# Altium schematic sheet BSPD.SchDoc
size A
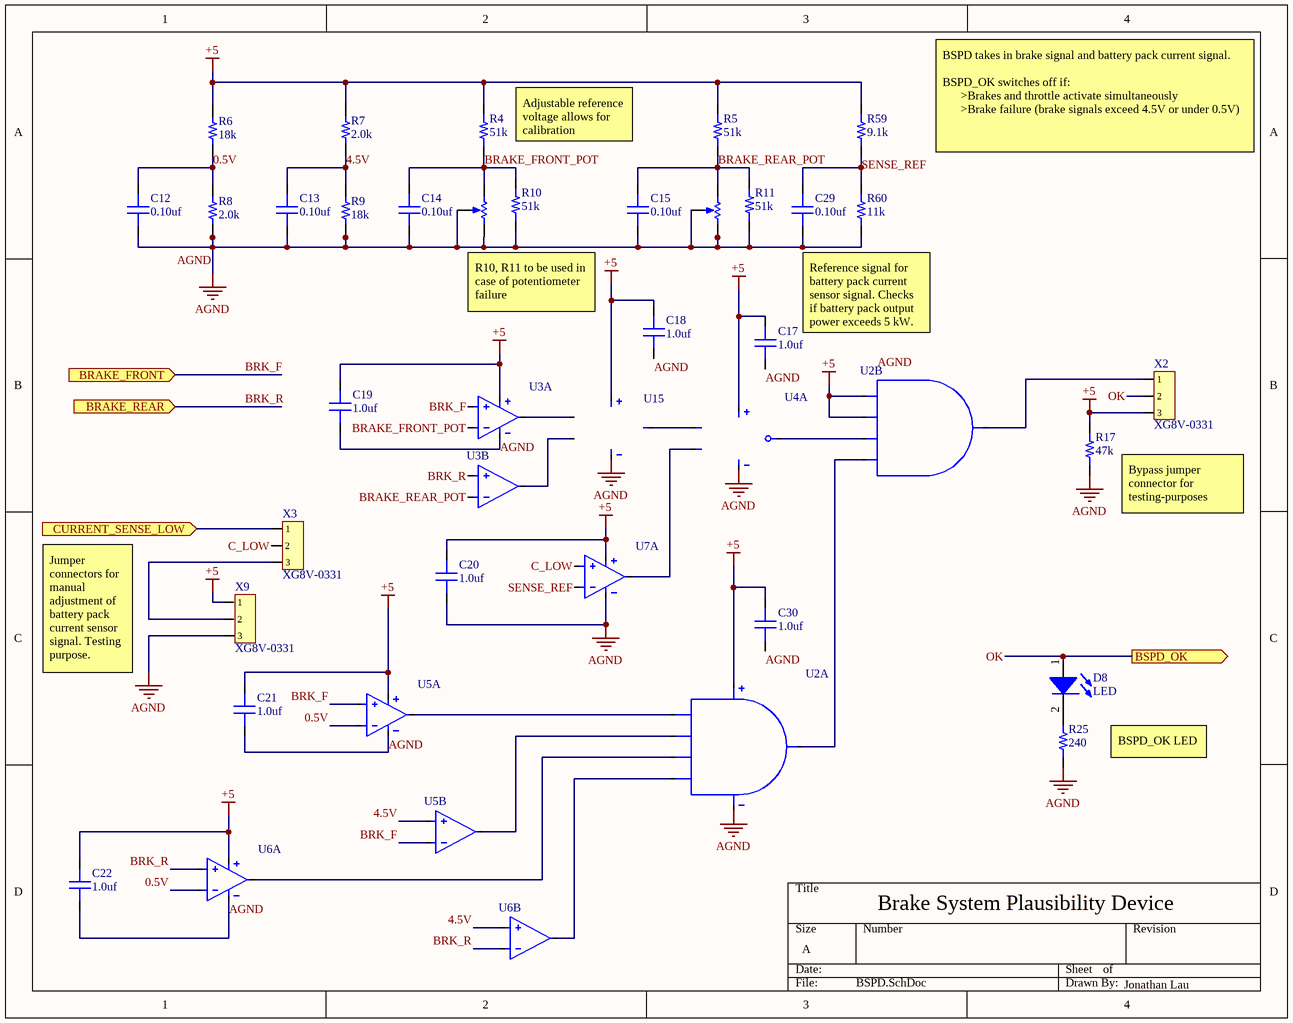
[diagram p0: BSPD.SchDoc]

## Parts
BRAKE_FRONT_POT  RV6LAYSA502A  [RV6LAYSA502A]  (value not drawn)
BRAKE_REAR_POT  RV6LAYSA502A  [RV6LAYSA502A]  (value not drawn)
C12  value 0.10uf  [CAP 0805/2012]  (hidden comment: Capacitor MLCC 0.10uf 16V CAP 0805/2012)
C13  value 0.10uf  [CAP 0805/2012]  (hidden comment: Capacitor MLCC 0.10uf 16V CAP 0805/2012)
C14  value 0.10uf  [CAP 0805/2012]  (hidden comment: Capacitor MLCC 0.10uf 16V CAP 0805/2012)
C15  value 0.10uf  [CAP 0805/2012]  (hidden comment: Capacitor MLCC 0.10uf 16V CAP 0805/2012)
C17  value 1.0uf  [CAP 0603/1608]  (hidden comment: Capacitor MLCC 1.0uf 16V CAP 0603/1608)
C18  value 1.0uf  [CAP 0603/1608]  (hidden comment: Capacitor MLCC 1.0uf 16V CAP 0603/1608)
C19  value 1.0uf  [CAP 0603/1608]  (hidden comment: Capacitor MLCC 1.0uf 16V CAP 0603/1608)
C20  value 1.0uf  [CAP 0603/1608]  (hidden comment: Capacitor MLCC 1.0uf 16V CAP 0603/1608)
C21  value 1.0uf  [CAP 0603/1608]  (hidden comment: Capacitor MLCC 1.0uf 16V CAP 0603/1608)
C22  value 1.0uf  [CAP 0603/1608]  (hidden comment: Capacitor MLCC 1.0uf 16V CAP 0603/1608)
C29  value 0.10uf  [CAP 0805/2012]  (hidden comment: Capacitor MLCC 0.10uf 16V CAP 0805/2012)
C30  value 1.0uf  [CAP 0603/1608]  (hidden comment: Capacitor MLCC 1.0uf 16V CAP 0603/1608)
D8  LED  [0805_LED]
R4  value 51k  [RES 0805/2012]  (hidden comment: Resistor 51k 0805 1/4W 5%)
R5  value 51k  [RES 0805/2012]  (hidden comment: Resistor 51k 0805 1/4W 5%)
R6  value 18k  [RES 0805/2012]  (hidden comment: Resistor 18k 0805 1/4W 5%)
R7  value 2.0k  [RES 0805/2012]  (hidden comment: Resistor 2.0k 0805 1/4W 5%)
R8  value 2.0k  [RES 0805/2012]  (hidden comment: Resistor 2.0k 0805 1/4W 5%)
R9  value 18k  [RES 0805/2012]  (hidden comment: Resistor 18k 0805 1/4W 5%)
R10  value 51k  [RES 0805/2012]  (hidden comment: Resistor 51k 0805 1/4W 5%)
R11  value 51k  [RES 0805/2012]  (hidden comment: Resistor 51k 0805 1/4W 5%)
R17  value 47k  [RES 0805/2012]  (hidden comment: Resistor 47k 0805 1/4W 5%)
R25  value 240  [RES 0805/2012]  (hidden comment: Resistor 240 0805 1/4W 1%)
R59  value 9.1k  [RES 0805/2012]  (hidden comment: Resistor 9.1k 0805 1/4W 1%)
R60  value 11k  [RES 0805/2012]  (hidden comment: Resistor 11k 0805 1/4W 1%)
U2  74HC21D AND Gate  [SOT108-1]  (value not drawn)  (parts A,B of 2)
U3  LT1018 Dual Comparator  [SOIC-8]  (value not drawn)  (parts A,B of 2)
U4  SN74LVC2G132DCUR  [R-PDSO-G8]  (value not drawn)  (part A of 2)
U5  LT1018 Dual Comparator  [SOIC-8]  (value not drawn)  (parts A,B of 2)
U6  LT1018 Dual Comparator  [SOIC-8]  (value not drawn)  (parts A,B of 2)
U7  LT1018 Dual Comparator  [SOIC-8]  (value not drawn)  (part A of 2)
U15  SN74LVC1G32 OR Gate  [SOT23-5]  (value not drawn)
X2  XG8V-0331  [XG8V-0331]
X3  XG8V-0331  [XG8V-0331]
X9  XG8V-0331  [XG8V-0331]

## Ports
BRAKE_FRONT (in), BRAKE_REAR (in), BSPD_OK (out), CURRENT_SENSE_LOW (in)

## Nets
+5: C17.2 C18.2 C19.2 C20.2 C21.2 C22.2 C30.2 R4.2 R5.2 R6.2 R7.2 R17.2 R59.2 U2.9(2A) U2.10(2B) U2.14(Vcc) U3.6(V+) U4.8(Vcc) U5.6(V+) U6.6(V+) U7.6(V+) U15.5(Vcc) X2.3 X9.1
AGND: BRAKE_FRONT_POT.2(TAP) BRAKE_FRONT_POT.3(BOT) BRAKE_REAR_POT.2(TAP) BRAKE_REAR_POT.3(BOT) C12.1 C13.1 C14.1 C15.1 C17.1 C18.1 C19.1 C20.1 C21.1 C22.1 C29.1 C30.1 R8.1 R9.1 R10.1 R11.1 R17.1 R25.1 R60.1 U2.7(GND) U3.2(V-) U4.4(GND) U5.2(V-) U6.2(V-) U7.2(V-) U15.3(GND) X9.3
0.5V: C12.2 R6.1 R8.2 U5.8(-IN_A) U6.8(-IN_A)
4.5V: C13.2 R7.1 R9.2 U5.3(+IN_B) U6.3(+IN_B)
BRAKE_FRONT_POT: BRAKE_FRONT_POT.1(TOP) C14.2 R4.1 R10.2 U3.8(-IN_A)
BRAKE_REAR_POT: BRAKE_REAR_POT.1(TOP) C15.2 R5.1 R11.2 U3.4(-IN_B)
BRK_F: U3.1(+IN_A) U5.1(+IN_A) U5.4(-IN_B) ; port BRAKE_FRONT
BRK_R: U3.3(+IN_B) U6.1(+IN_A) U6.4(-IN_B) ; port BRAKE_REAR
C_LOW: U7.1(+IN_A) X3.2
CURRENT_SENSE_LOW: X3.1 ; port CURRENT_SENSE_LOW
OK: D8.1(A) X2.2 ; port BSPD_OK
SENSE_REF: C29.2 R59.1 R60.2 U7.8(-IN_A)
NetD8_2: D8.2(K) R25.2
NetU2_1: U2.1(1A) U5.7(OUT_A)
NetU2_2: U2.2(1B) U5.5(OUT_B)
NetU2_4: U2.4(1C) U6.7(OUT_A)
NetU2_5: U2.5(1D) U6.5(OUT_B)
NetU2_6: U2.6(1Y) U2.13(2D)
NetU2_8: U2.8(2Y) X2.1
NetU2_12: U2.12(2C) U4.7(1Y)
NetU3_5: U3.5(OUT_B) U15.2(B)
NetU3_7: U3.7(OUT_A) U15.1(A)
NetU4_1: U4.1(1A) U15.4(Y)
NetU4_2: U4.2(1B) U7.7(OUT_A)
NetX3_3: X3.3 X9.2

## Notes on the sheet
- Adjustable reference voltage allows for calibration
- BSPD takes in brake signal and battery pack current signal.
  BSPD_OK switches off if:
  >Brakes and throttle activate simultaneously
  >Brake failure (brake signals exceed 4.5V or under 0.5V)
- R10, R11 to be used in case of potentiometer failure
- Reference signal for battery pack current sensor signal. Checks if battery pack output power exceeds 5 kW.
- Bypass jumper connector for testing-purposes
- Jumper connectors for manual adjustment of battery pack current sensor signal. Testing purpose.
- BSPD_OK LED
- Brake System Plausibility Device
- Jonathan Lau
- Labels drawn without touching a wire or pin: AGND

## Library data of the parts
BRAKE_FRONT_POT BRAKE_REAR_POT = 1: idTable: 1; Name: RV6LAYSA502A_rotary_pot; Value: 100-5M Ohms; Manufacturer_id: 1; Drawer_id: 1; Link: https://www.digikey.com/product-detail/en/precision-electronics-corporation/RV6LAYSA502A/RV6L502C-ND/222820; ComponentLink1Description: Datasheet
C12-C15 C29 = 343: Manufacturer_id: 1; idCapacitor: 343; Name: Cap_0.10uf_16V_CAP 0805/2012; Dielectric: Ceramic; Created_By: Nick Mah; Drawer_id: 1; Voltage_Rating: 16V; Package: CAP 0805/2012; Created_Date: 10/20/2018
C17-C22 C30 = 229: Manufacturer_id: 1; idCapacitor: 229; Name: Cap_1.0uf_16V_CAP 0603/1608; Dielectric: Ceramic; Created_By: Nick Mah; Drawer_id: 1; Voltage_Rating: 16V; Package: CAP 0603/1608; Created_Date: 10/20/2018
D8 = 2: Manufacturer_id: 1; idLED: 2; Name: CMD17_0805_GREEN; Value: Green; Brightness: 7mcd; Id: 20mA; Vf: 2.1V; Drawer_id: 1; Package: 0805; Link: https://www.digikey.com/product-detail/en/visual-communications-company-vcc/CMD17-21VGD-TR8/L62505CT-ND/254936
R4 R5 R10 R11 = 1842: Manufacturer_id: 1; idResistor: 1842; Name: Res_51k_0805_1/4W_5%; Created_By: Nick Mah; Supplier 1: Digi-Key; Drawer_id: 1; Tolerance: 5%; Power: 1/4W; Package: 0805; ComponentLink1Description: Datasheet; Created_Date: 2018-10-20
R6 R9 = 1831: Manufacturer_id: 1; idResistor: 1831; Name: Res_18k_0805_1/4W_5%; Created_By: Nick Mah; Supplier 1: Digi-Key; Drawer_id: 1; Tolerance: 5%; Power: 1/4W; Package: 0805; ComponentLink1Description: Datasheet; Created_Date: 2018-10-20
R7 R8 = 1808: Manufacturer_id: 1; idResistor: 1808; Name: Res_2.0k_0805_1/4W_5%; Created_By: Nick Mah; Supplier 1: Digi-Key; Drawer_id: 1; Tolerance: 5%; Power: 1/4W; Package: 0805; ComponentLink1Description: Datasheet; Created_Date: 2018-10-20
R17 = 1841: Manufacturer_id: 1; idResistor: 1841; Name: Res_47k_0805_1/4W_5%; Created_By: Nick Mah; Supplier 1: Digi-Key; Drawer_id: 1; Tolerance: 5%; Power: 1/4W; Package: 0805; ComponentLink1Description: Datasheet; Created_Date: 2018-10-20
R25 = 706: Manufacturer_id: 1; idResistor: 706; Name: Res_240_0805_1/4W_1%; Created_By: Nick Mah; Supplier 1: Digi-Key; Drawer_id: 1; Tolerance: 1%; Power: 1/4W; Package: 0805; ComponentLink1Description: Datasheet; Created_Date: 2018-10-20
R59 = 744: Manufacturer_id: 1; idResistor: 744; Name: Res_9.1k_0805_1/4W_1%; Created_By: Nick Mah; Supplier 1: Digi-Key; Drawer_id: 1; Tolerance: 1%; Power: 1/4W; Package: 0805; ComponentLink1Description: Datasheet; Created_Date: 2018-10-20
R60 = 746: Manufacturer_id: 1; idResistor: 746; Name: Res_11k_0805_1/4W_1%; Created_By: Nick Mah; Supplier 1: Digi-Key; Drawer_id: 1; Tolerance: 1%; Power: 1/4W; Package: 0805; ComponentLink1Description: Datasheet; Created_Date: 2018-10-20
U2 = 15: Manufacturer_id: 1; idIC_Misc: 15; Name: 74HC21D_AND_Gate; Drawer_id: 1
U3 U5-U7 = 7: Manufacturer_id: 1; MfrPartNo: LT1018CS8#PBF; idIC_Misc: 7; Drawer_id: 1; Name: LT1018 Dual Comparator; Link: https://www.digikey.com/product-detail/en/linear-technology-analog-devices/LT1018CS8-PBF/LT1018CS8-PBF-ND/894434
U4 = 12: Manufacturer_id: 1; idIC_Misc: 12; Name: SN74LVC2G132DCUR 2channel NAND Gate; Drawer_id: 1
U15 = 14: Manufacturer_id: 1; idIC_Misc: 14; Drawer_id: 1; Name: SN74LVC1G32 OR GATE
X2 X3 X9 = 8: 3 pin header; Manufacturer_id: 1; idConn: 8; Name: XG8V-0331_3pin_header; Num_Contacts: 3; Pitch: 2.54 mm; Drawer_id: 1; Link: https://www.digikey.com/products/en/connectors-interconnects/rectangular-connectors-headers-male-pins/314?k=jumper&k=&pkeyword=jumper&pv88=5&sf=0&FV=ffe0013a&quantity=&ColumnSort=0&page=1&pageSize=25; ComponentLink1Description: Datasheet